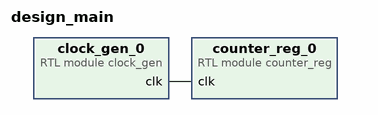
[diagram p0: block diagram of the top level]
# Vivado block design design_main, xc7vx485tffg1157-1, Vivado 2020.2
create_bd_design design_main

create_bd_cell -type module -reference clock_gen clock_gen_0
create_bd_cell -type module -reference counter_reg counter_reg_0

# ---- connections ----

connect_bd_net [get_bd_pins clock_gen_0/clk] [get_bd_pins counter_reg_0/clk]

validate_bd_design
save_bd_design
